# Altium schematic sheet ECU_Sheet6.SchDoc
size A3
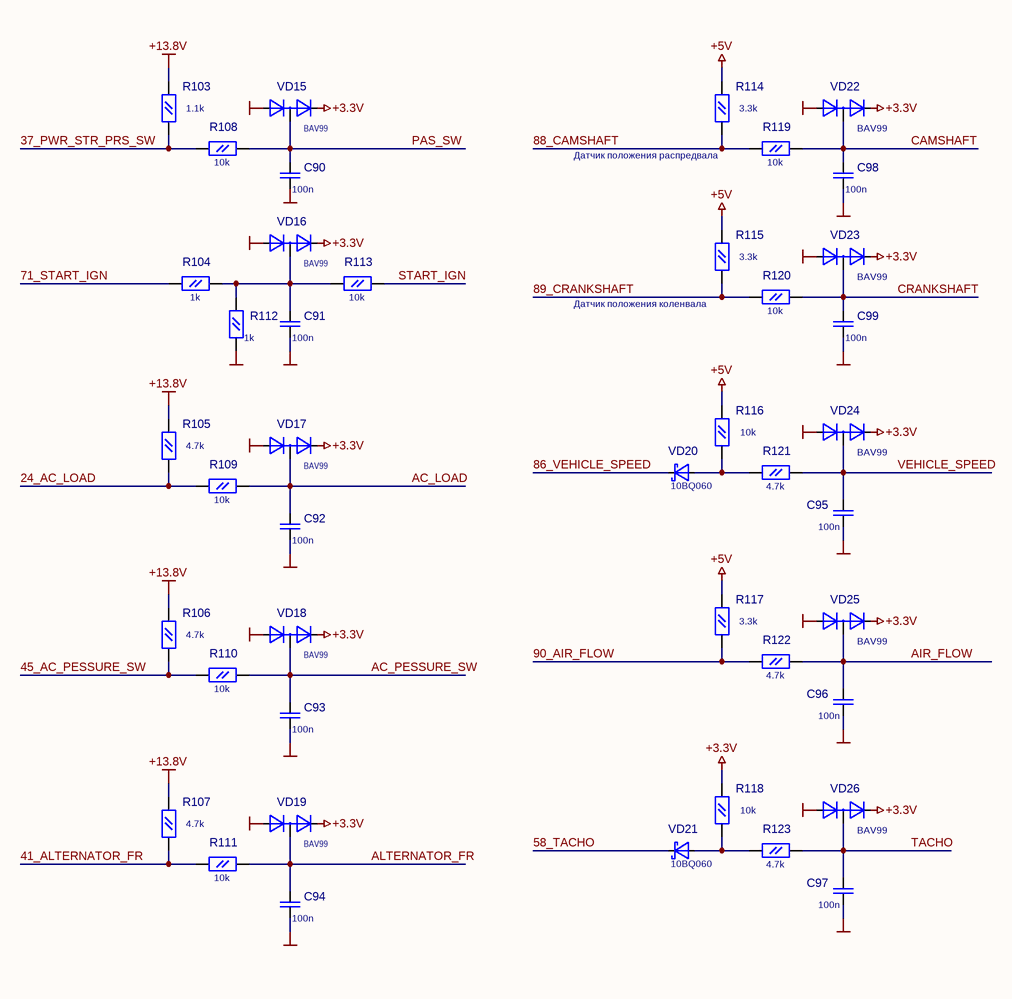
[diagram p0: ECU_Sheet6.SchDoc]

## Parts
C90  value 100n  [C0805L]  (hidden comment: CSMD)
C91  value 100n  [C0805L]  (hidden comment: CSMD)
C92  value 100n  [C0805L]  (hidden comment: CSMD)
C93  value 100n  [C0805L]  (hidden comment: CSMD)
C94  value 100n  [C0805L]  (hidden comment: CSMD)
C95  value 100n  [C0805L]  (hidden comment: CSMD)
C96  value 100n  [C0805L]  (hidden comment: CSMD)
C97  value 100n  [C0805L]  (hidden comment: CSMD)
C98  value 100n  [C0805L]  (hidden comment: CSMD)
C99  value 100n  [C0805L]  (hidden comment: CSMD)
R103  value 1.1k  [R0805L]  (hidden comment: RSMD)
R104  value 1k  [R0805L]  (hidden comment: RSMD)
R105  value 4.7k  [R0805L]  (hidden comment: RSMD)
R106  value 4.7k  [R0805L]  (hidden comment: RSMD)
R107  value 4.7k  [R0805L]  (hidden comment: RSMD)
R108  value 10k  [R0805L]  (hidden comment: RSMD)
R109  value 10k  [R0805L]  (hidden comment: RSMD)
R110  value 10k  [R0805L]  (hidden comment: RSMD)
R111  value 10k  [R0805L]  (hidden comment: RSMD)
R112  value 1k  [R0805L]  (hidden comment: RSMD)
R113  value 10k  [R0805L]  (hidden comment: RSMD)
R114  value 3.3k  [R0805L]  (hidden comment: RSMD)
R115  value 3.3k  [R0805L]  (hidden comment: RSMD)
R116  value 10k  [R0805L]  (hidden comment: RSMD)
R117  value 3.3k  [R0805L]  (hidden comment: RSMD)
R118  value 10k  [R0805L]  (hidden comment: RSMD)
R119  value 10k  [R0805L]  (hidden comment: RSMD)
R120  value 10k  [R0805L]  (hidden comment: RSMD)
R121  value 4.7k  [R0805L]  (hidden comment: RSMD)
R122  value 4.7k  [R0805L]  (hidden comment: RSMD)
R123  value 4.7k  [R0805L]  (hidden comment: RSMD)
VD15  BAV99  [SOT-23]
VD16  BAV99  [SOT-23]
VD17  BAV99  [SOT-23]
VD18  BAV99  [SOT-23]
VD19  BAV99  [SOT-23]
VD20  10BQ060  [DO-214AA SMB]
VD21  10BQ060  [DO-214AA SMB]
VD22  BAV99  [SOT-23]
VD23  BAV99  [SOT-23]
VD24  BAV99  [SOT-23]
VD25  BAV99  [SOT-23]
VD26  BAV99  [SOT-23]

## Nets
+3.3V: R118.2(Pin2) VD15.2(K) VD16.2(K) VD17.2(K) VD18.2(K) VD19.2(K) VD22.2(K) VD23.2(K) VD24.2(K) VD25.2(K) VD26.2(K)
+5V: R114.2(Pin2) R115.2(Pin2) R116.2(Pin2) R117.2(Pin2)
+13.8V: R103.2(Pin2) R105.2(Pin2) R106.2(Pin2) R107.2(Pin2)
GND: C90.2 C91.2 C92.2 C93.2 C94.2 C95.2 C96.2 C97.2 C98.2 C99.2 R112.1(Pin1) VD15.1(A) VD16.1(A) VD17.1(A) VD18.1(A) VD19.1(A) VD22.1(A) VD23.1(A) VD24.1(A) VD25.1(A) VD26.1(A)
24_AC_LOAD: R105.1(Pin1) R109.1(Pin1)
37_PWR_STR_PRS_SW: R103.1(Pin1) R108.1(Pin1)
41_ALTERNATOR_FR: R107.1(Pin1) R111.1(Pin1)
45_AC_PESSURE_SW: R106.1(Pin1) R110.1(Pin1)
58_TACHO: VD21.2
71_START_IGN: R104.1(Pin1)
86_VEHICLE_SPEED: VD20.2
88_CAMSHAFT: R114.1(Pin1) R119.1(Pin1)
89_CRANKSHAFT: R115.1(Pin1) R120.1(Pin1)
90_AIR_FLOW: R117.1(Pin1) R122.1(Pin1)
AC_LOAD: C92.1 R109.2(Pin2) VD17.3(C)
AC_PESSURE_SW: C93.1 R110.2(Pin2) VD18.3(C)
AIR_FLOW: C96.1 R122.2(Pin2) VD25.3(C)
ALTERNATOR_FR: C94.1 R111.2(Pin2) VD19.3(C)
CAMSHAFT: C98.1 R119.2(Pin2) VD22.3(C)
CRANKSHAFT: C99.1 R120.2(Pin2) VD23.3(C)
PAS_SW: C90.1 R108.2(Pin2) VD15.3(C)
START_IGN: R113.2(Pin2)
TACHO: C97.1 R123.2(Pin2) VD26.3(C)
VEHICLE_SPEED: C95.1 R121.2(Pin2) VD24.3(C)
NetC91_1: C91.1 R104.2(Pin2) R112.2(Pin2) R113.1(Pin1) VD16.3(C)
NetR116_1: R116.1(Pin1) R121.1(Pin1) VD20.1
NetR118_1: R118.1(Pin1) R123.1(Pin1) VD21.1

## Notes on the sheet
- (near R114) Датчик положения распредвала
- (near R115) Датчик положения коленвала
- Title
- Date:
- Size
- A3
- Number
- Sheet
- of
- Revision
- File:
- Drawn By:

## Library data of the parts
C90-C99 = CSMD: C0603; Voltage: *; Part Field 1: *; Part Field 2: *
R103-R123 = RSMD: R0805
VD15-VD19 VD22-VD26 = BAV99: Value: *
VD20 VD21 = 10BQ060: Value: *